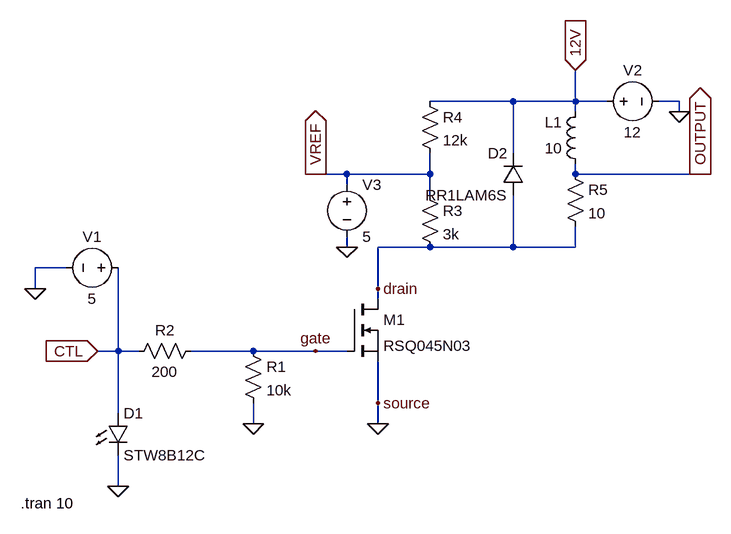
[diagram p0: schematic SolenoidValveControlCircuit.asc]
SolenoidValveControlCircuit.asc, the LTspice schematic file:
Version 4
SHEET 1 904 680
WIRE 448 -160 320 -160
WIRE 544 -160 544 -208
WIRE 544 -160 448 -160
WIRE 592 -160 544 -160
WIRE 704 -160 672 -160
WIRE 544 -144 544 -160
WIRE 704 -144 704 -160
WIRE 448 -80 448 -160
WIRE 144 -48 128 -48
WIRE 192 -48 144 -48
WIRE 320 -48 320 -80
WIRE 320 -48 192 -48
WIRE 544 -48 544 -64
WIRE 736 -48 544 -48
WIRE 752 -48 736 -48
WIRE 192 -32 192 -48
WIRE 320 -16 320 -48
WIRE 192 64 192 48
WIRE 320 64 240 64
WIRE 448 64 448 -16
WIRE 448 64 320 64
WIRE 544 64 544 32
WIRE 544 64 448 64
WIRE -240 96 -288 96
WIRE -288 128 -288 96
WIRE 240 128 240 64
WIRE 240 144 240 128
WIRE -160 224 -160 96
WIRE -160 224 -192 224
WIRE -128 224 -160 224
WIRE 48 224 -48 224
WIRE 144 224 48 224
WIRE 192 224 144 224
WIRE 240 304 240 240
WIRE -160 320 -160 224
WIRE 48 336 48 304
WIRE 240 336 240 304
WIRE -160 432 -160 384
FLAG -192 224 CTL
IOPIN -192 224 In
FLAG 240 336 0
FLAG 144 -48 VREF
IOPIN 144 -48 Out
FLAG 544 -208 12V
IOPIN 544 -208 In
FLAG -160 432 0
FLAG 48 336 0
FLAG 736 -48 OUTPUT
IOPIN 736 -48 Out
FLAG -288 128 0
FLAG 704 -144 0
FLAG 192 64 0
FLAG 144 224 gate
FLAG 240 128 drain
FLAG 240 304 source
SYMBOL nmos 192 144 R0
SYMATTR InstName M1
SYMATTR Value RSQ045N03
SYMBOL res 32 208 R0
SYMATTR InstName R1
SYMATTR Value 10k
SYMBOL res -32 208 R90
WINDOW 0 0 56 VBottom 2
WINDOW 3 32 56 VTop 2
SYMATTR InstName R2
SYMATTR Value 200
SYMBOL LED -176 320 R0
SYMATTR InstName D1
SYMATTR Value STW8B12C
SYMBOL res 304 -32 R0
SYMATTR InstName R3
SYMATTR Value 3k
SYMBOL res 304 -176 R0
SYMATTR InstName R4
SYMATTR Value 12k
SYMBOL diode 464 -16 R180
WINDOW 0 24 64 Left 2
WINDOW 3 24 0 Left 2
SYMATTR InstName D2
SYMATTR Value RR1LAM6S
SYMBOL voltage -144 96 R90
WINDOW 0 -32 56 VBottom 2
WINDOW 3 32 56 VTop 2
WINDOW 123 0 0 Left 0
WINDOW 39 0 0 Left 0
SYMATTR InstName V1
SYMATTR Value 5
SYMBOL voltage 576 -160 R270
WINDOW 0 32 56 VTop 2
WINDOW 3 -32 56 VBottom 2
WINDOW 123 0 0 Left 0
WINDOW 39 0 0 Left 0
SYMATTR InstName V2
SYMATTR Value 12
SYMBOL voltage 192 -48 R0
WINDOW 123 0 0 Left 0
WINDOW 39 0 0 Left 0
SYMATTR InstName V3
SYMATTR Value 5
SYMBOL ind 560 -48 R180
WINDOW 0 36 80 Left 2
WINDOW 3 36 40 Left 2
SYMATTR InstName L1
SYMATTR Value 10
SYMBOL res 528 -64 R0
SYMATTR InstName R5
SYMATTR Value 10
TEXT -310 458 Left 2 !.tran 10

The netlist it stands for:
* SolenoidValveControlCircuit.asc
M1 drain gate 0 0 RSQ045N03
R1 gate 0 10k
R2 gate CTL 200
D1 CTL 0 STW8B12C
R3 VREF drain 3k
R4 12V VREF 12k
D2 drain 12V RR1LAM6S
V1 CTL 0 5
V2 12V 0 12
V3 VREF 0 5
L1 OUTPUT 12V 10
R5 OUTPUT drain 10
.model D D
.lib standard.dio
.model NMOS NMOS
.model PMOS PMOS
.lib standard.mos
.tran 10
.backanno
.end